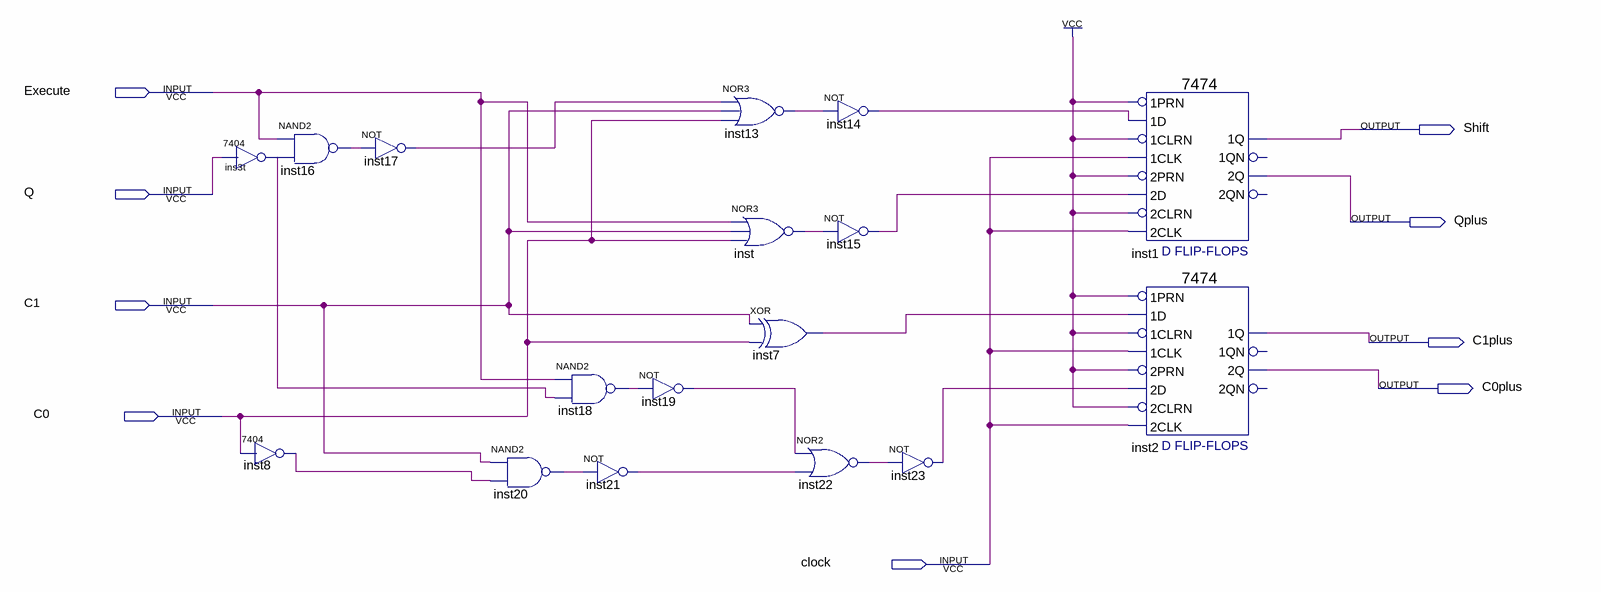
[diagram p0: schematic sheet]
// Quartus schematic controlunit.bdf as structural Verilog: 17 symbols, 9 pins
module controlunit (
  input  Execute,
  input  Q,
  input  C1,
  input  C0,
  input  clock,
  output Shift,
  output Qplus,
  output C1plus,
  output C0plus
);

  wire ins3t_1, inst7_out, inst8_1, inst13_out, inst14_out, inst15_out, inst16_out, inst17_out, inst18_out,
       inst19_out, inst20_out, inst21_out, inst22_out, inst23_out, inst_out;

  nand inst16 (inst16_out, Execute, ins3t_1);
  \7404  ins3t (.\2 (Q), .\1 (ins3t_1));
  \7404  inst8 (.\2 (C0), .\1 (inst8_1));
  not inst17 (inst17_out, inst16_out);
  nand inst20 (inst20_out, C1, inst8_1);
  nand inst18 (inst18_out, Execute, ins3t_1);
  not inst21 (inst21_out, inst20_out);
  not inst19 (inst19_out, inst18_out);
  nor inst13 (inst13_out, inst17_out, C1, C0);
  nor inst (inst_out, Execute, C1, C0);
  xor inst7 (inst7_out, C1, C0);
  nor inst22 (inst22_out, inst19_out, inst21_out);
  not inst14 (inst14_out, inst13_out);
  not inst15 (inst15_out, inst_out);
  not inst23 (inst23_out, inst22_out);
  \7474  inst1 (
    .\2D (inst15_out), .\2PRN (1'b1), .\1CLK (clock), .\1D (inst14_out), .\1PRN (1'b1), .\2CLK (clock),
    .\2CLRN (1'b1), .\1CLRN (1'b1), .\2Q (Qplus), .\1Q (Shift));  // open: 1QN, 2QN
  \7474  inst2 (
    .\2D (inst23_out), .\2PRN (1'b1), .\1CLK (clock), .\1D (inst7_out), .\1PRN (1'b1), .\2CLK (clock),
    .\2CLRN (1'b1), .\1CLRN (1'b1), .\2Q (C0plus), .\1Q (C1plus));  // open: 1QN, 2QN
endmodule
